# Altium project 最小系统.PrjPCB
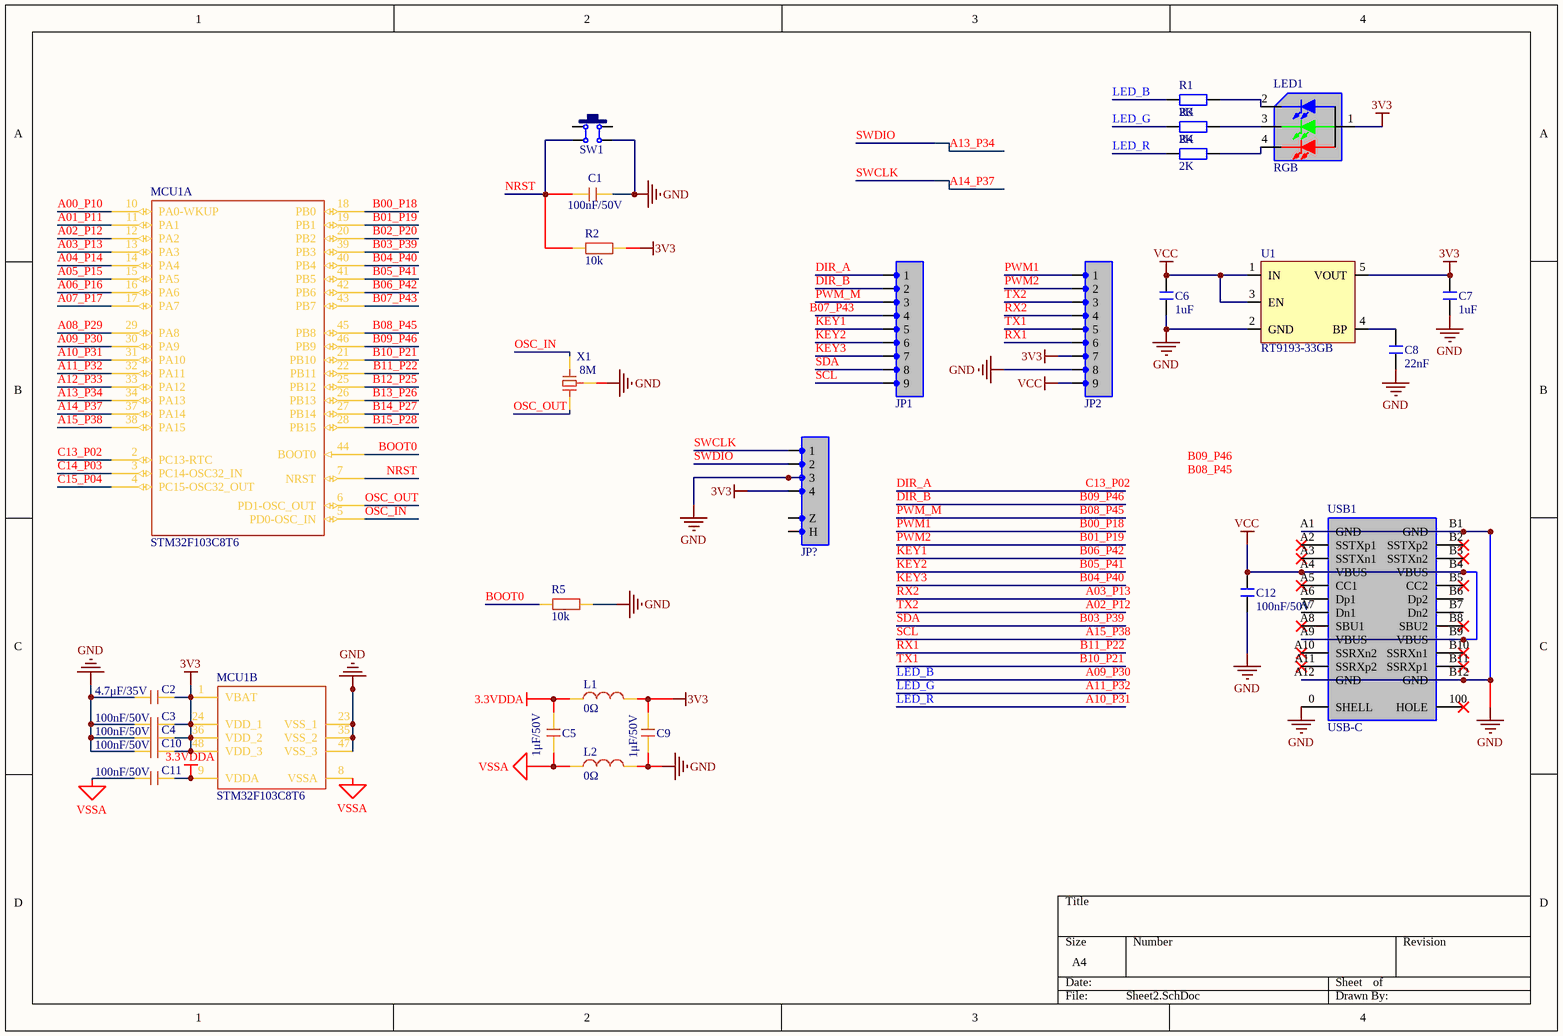
[diagram p0: Sheet2.SchDoc]
1 sheet, 28 parts. Net scope: global (net labels, ports and power ports of the same name join across sheets).
Board file: 最小系统.PcbDoc

## Sheet Sheet2.SchDoc
size A4

### Parts
C1  100nF/50V  [C 0603_L]
C2  4.7μF/35V  [C 0603_L]
C3  100nF/50V  [C 0603_L]
C4  100nF/50V  [C 0603_L]
C5  1μF/50V  [C 0603_L]
C6  1uF  [C 0603_L]
C7  1uF  [C 0603_L]
C8  22nF  [C 0402_L]
C9  1μF/50V  [C 0603_L]
C10  100nF/50V  [C 0603_L]
C11  100nF/50V  [C 0603_L]
C12  100nF/50V  [C 0603_L]
JP1  HDR-1X9  [HDR2.54-LI-9P]  (value not drawn)
JP2  HDR-1X9  [HDR2.54-LI-9P]  (value not drawn)
JP?  HDR-1X4  [HDR2.54-LI-4P]  (value not drawn)
L1  0Ω  [L 0603]
L2  0Ω  [L 0603]
LED1  RGB  [LED 3528-RGB]
MCU1  STM32F103C8T6  [LQFP48 7X7_L]  (parts A,B of 2)
R1  2K  [R 0603_L]
R2  10k  [R 0603_L]
R3  2K  [R 0603_L]
R4  2K  [R 0603_L]
R5  10k  [R 0603_L]
SW1  3.2x4.2x2.5  [TSW SMD-3.2*4.2*2.5]  (value not drawn)
U1  RT9193-33GB  [SOT23-5]
USB1  USB-C  [USB-C/S_B]
X1  8M  [OSC 3213-3P]

### Nets
3.3VDDA: C5.2 C11.2 L1.1 MCU1.9(VDDA)
3V3: C2.2 C3.2 C4.2 C7.1 C9.2 C10.2 JP2.7 JP?.4 L1.2 LED1.1 MCU1.1(VBAT) MCU1.24(VDD_1) MCU1.36(VDD_2) MCU1.48(VDD_3) R2.2 U1.5(VOUT)
GND: C1.2 C2.1 C3.1 C4.1 C6.2 C7.2 C8.2 C9.1 C10.1 C12.2 JP2.8 JP?.3 L2.2 MCU1.23(VSS_1) MCU1.35(VSS_2) MCU1.47(VSS_3) R5.2 SW1.4 U1.2(GND) USB1.0(SHELL) USB1.A1(GND) USB1.A12(GND) USB1.B1(GND) USB1.B12(GND) X1.3
VCC: C6.1 C12.1 JP2.9 U1.1(IN) U1.3(EN) USB1.A4(VBUS) USB1.A9(VBUS) USB1.B4(VBUS) USB1.B9(VBUS)
VSSA: C5.1 C11.1 L2.1 MCU1.8(VSSA)
A00_P10: MCU1.10(PA0-WKUP)
A01_P11: MCU1.11(PA1)
A02_P12: JP2.3 MCU1.12(PA2)  [also labelled TX2]
A03_P13: JP2.4 MCU1.13(PA3)  [also labelled RX2]
A04_P14: MCU1.14(PA4)
A05_P15: MCU1.15(PA5)
A06_P16: MCU1.16(PA6)
A07_P17: MCU1.17(PA7)
A08_P29: MCU1.29(PA8)
A09_P30: MCU1.30(PA9) R1.1  [also labelled LED_B]
A10_P31: MCU1.31(PA10) R4.1  [also labelled LED_R]
A11_P32: MCU1.32(PA11) R3.1  [also labelled LED_G]
A12_P33: MCU1.33(PA12)
A13_P34: JP?.2 MCU1.34(PA13)  [also labelled SWDIO]
A14_P37: JP?.1 MCU1.37(PA14)  [also labelled SWCLK]
A15_P38: JP1.9 MCU1.38(PA15)  [also labelled SCL]
B00_P18: JP2.1 MCU1.18(PB0)  [also labelled PWM1]
B01_P19: JP2.2 MCU1.19(PB1)  [also labelled PWM2]
B02_P20: MCU1.20(PB2)
B03_P39: JP1.8 MCU1.39(PB3)  [also labelled SDA]
B04_P40: JP1.7 MCU1.40(PB4)  [also labelled KEY3]
B05_P41: JP1.6 MCU1.41(PB5)  [also labelled KEY2]
B06_P42: JP1.5 MCU1.42(PB6)  [also labelled KEY1]
B07_P43: JP1.4 MCU1.43(PB7)
B08_P45: JP1.3 MCU1.45(PB8)  [also labelled PWM_M]
B09_P46: JP1.2 MCU1.46(PB9)  [also labelled DIR_B]
B10_P21: JP2.5 MCU1.21(PB10)  [also labelled TX1]
B11_P22: JP2.6 MCU1.22(PB11)  [also labelled RX1]
B12_P25: MCU1.25(PB12)
B13_P26: MCU1.26(PB13)
B14_P27: MCU1.27(PB14)
B15_P28: MCU1.28(PB15)
BOOT0: MCU1.44(BOOT0) R5.1
C13_P02: JP1.1 MCU1.2(PC13-RTC)  [also labelled DIR_A]
C14_P03: MCU1.3(PC14-OSC32_IN)
C15_P04: MCU1.4(PC15-OSC32_OUT)
NRST: C1.1 MCU1.7(NRST) R2.1 SW1.3
OSC_IN: MCU1.5(PD0-OSC_IN) X1.2
OSC_OUT: MCU1.6(PD1-OSC_OUT) X1.1
NetC8_1: C8.1 U1.4(BP)
NetLED1_2: LED1.2 R1.2
NetLED1_3: LED1.3 R3.2
NetLED1_4: LED1.4 R4.2

Not connected (* = marked no-connect by the designer): JP? 0(Z) 100(H); SW1 1 2; USB1 100(HOLE)* A2(SSTXp1)* A3(SSTXn1)* A5(CC1)* A6(Dp1) A7(Dn1) A8(SBU1)* A10(SSRXn2)* A11(SSRXp2)* B2(SSTXp2)* B3(SSTXn2)* B5(CC2)* B6(Dp2) B7(Dn2) B8(SBU2)* B10(SSRXn1)* B11(SSRXp1)*

### Notes on the sheet
- Labels drawn without touching a wire or pin: B08_P45, B09_P46

### Library data of the parts
C1-C5 C9-C11 = 无极贴片电容: 贴片电容
C6-C8 C12 = C: 无极性贴片电容; 版权归属: 源创客; BOM名称: 无极性贴片电容; 学习资源: www.ooocke.com
JP1 JP2 = Header 9: 9P接插件; 版权归属: 源创客; BOM名称: 9P接插件; 学习资源: www.ooocke.com
JP? = Header 4: 4P接插件; 版权归属: 源创客; BOM名称: 4P接插件; 学习资源: www.ooocke.com
L1 L2 = 磁珠: 小功率贴片电感
LED1 = LED-RGB-A: 共阳三基色LED; BOM名称: 三基色LED; 版权归属: 源创客; 学习资源: www.ooocke.com
MCU1 = STM32F103C8T6: STM32F103C8T6是一款由意法半导体公司（ST）推出的基于Cortex-M3内核的32位微控制器，硬件采用LQFP48封装，属于ST公司微控制器中的STM32系列。
R1 R3 R4 = R: 贴片电阻; 版权归属: 源创客; BOM名称: 贴片电阻; 学习资源: www.ooocke.com
R2 R5 = 电阻: 贴片电阻1%精度
SW1 = TSW SMD-3x4_D: 3.2x4.2轻触开关; BOM名称: 3x6轻触开关; 版权归属: 源创客; 学习资源: www.ooocke.com
USB1 = USB-C/S: USB-C型母接口; 版权归属: 源创客; BOM名称: USB-C型母接口; 学习资源: www.ooocke.com
X1 = XTAL-3P: 3脚内置电容无源晶振